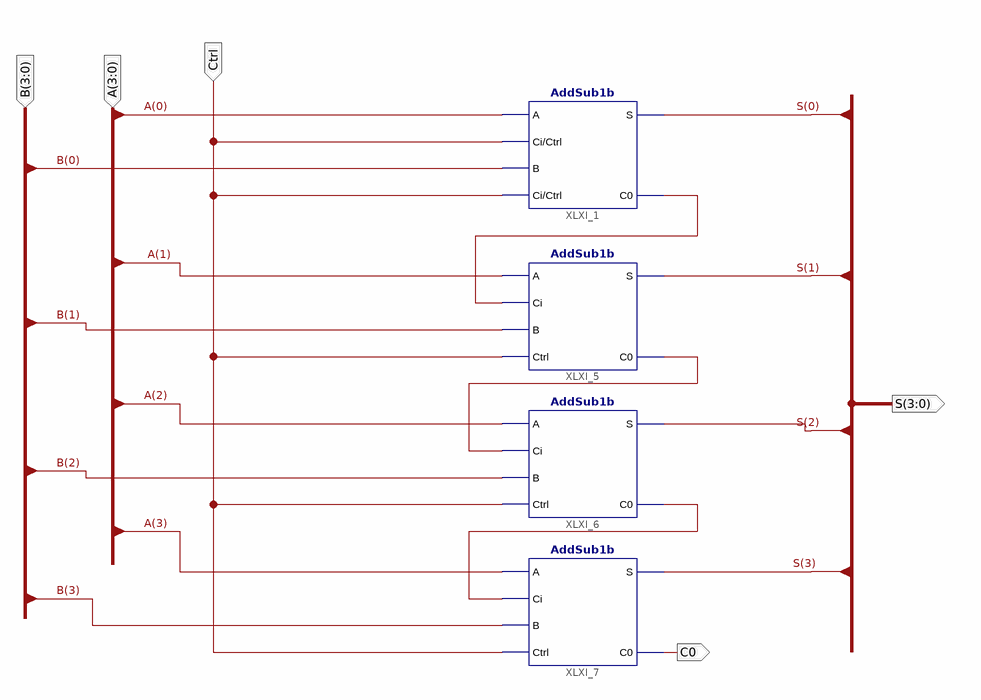
[diagram p0: schematic sheet 1]
// Xilinx ISE schematic AddSub4b.sch (kintex7) as structural Verilog: 4 symbols, 5 ports
module AddSub4b (
  input  Ctrl,
  input  [3:0] A,
  input  [3:0] B,
  output C0,
  output [3:0] S
);

  wire XLXN_3, XLXN_4, XLXN_6;

  AddSub1b XLXI_1 (.A(A[0]), .Ci(Ctrl), .B(B[0]), .Ctrl(Ctrl), .S(S[0]), .C0(XLXN_3));
  AddSub1b XLXI_5 (.A(A[1]), .Ci(XLXN_3), .B(B[1]), .Ctrl(Ctrl), .S(S[1]), .C0(XLXN_4));
  AddSub1b XLXI_6 (.A(A[2]), .Ci(XLXN_4), .B(B[2]), .Ctrl(Ctrl), .S(S[2]), .C0(XLXN_6));
  AddSub1b XLXI_7 (.A(A[3]), .Ci(XLXN_6), .B(B[3]), .Ctrl(Ctrl), .S(S[3]), .C0(C0));
endmodule
